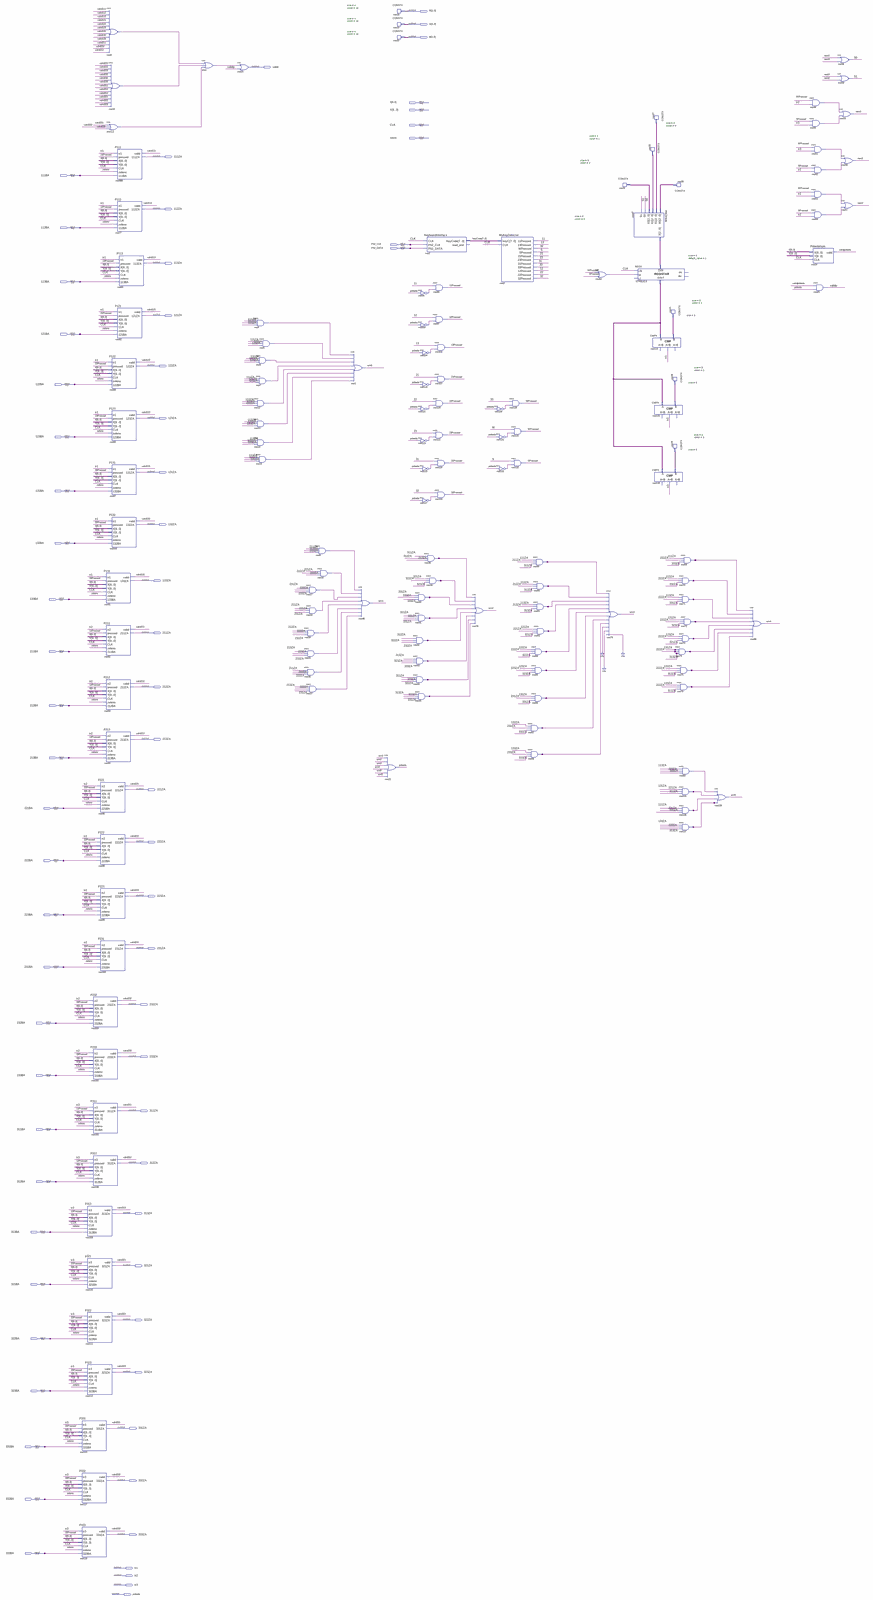
[diagram p0: schematic sheet, whole]
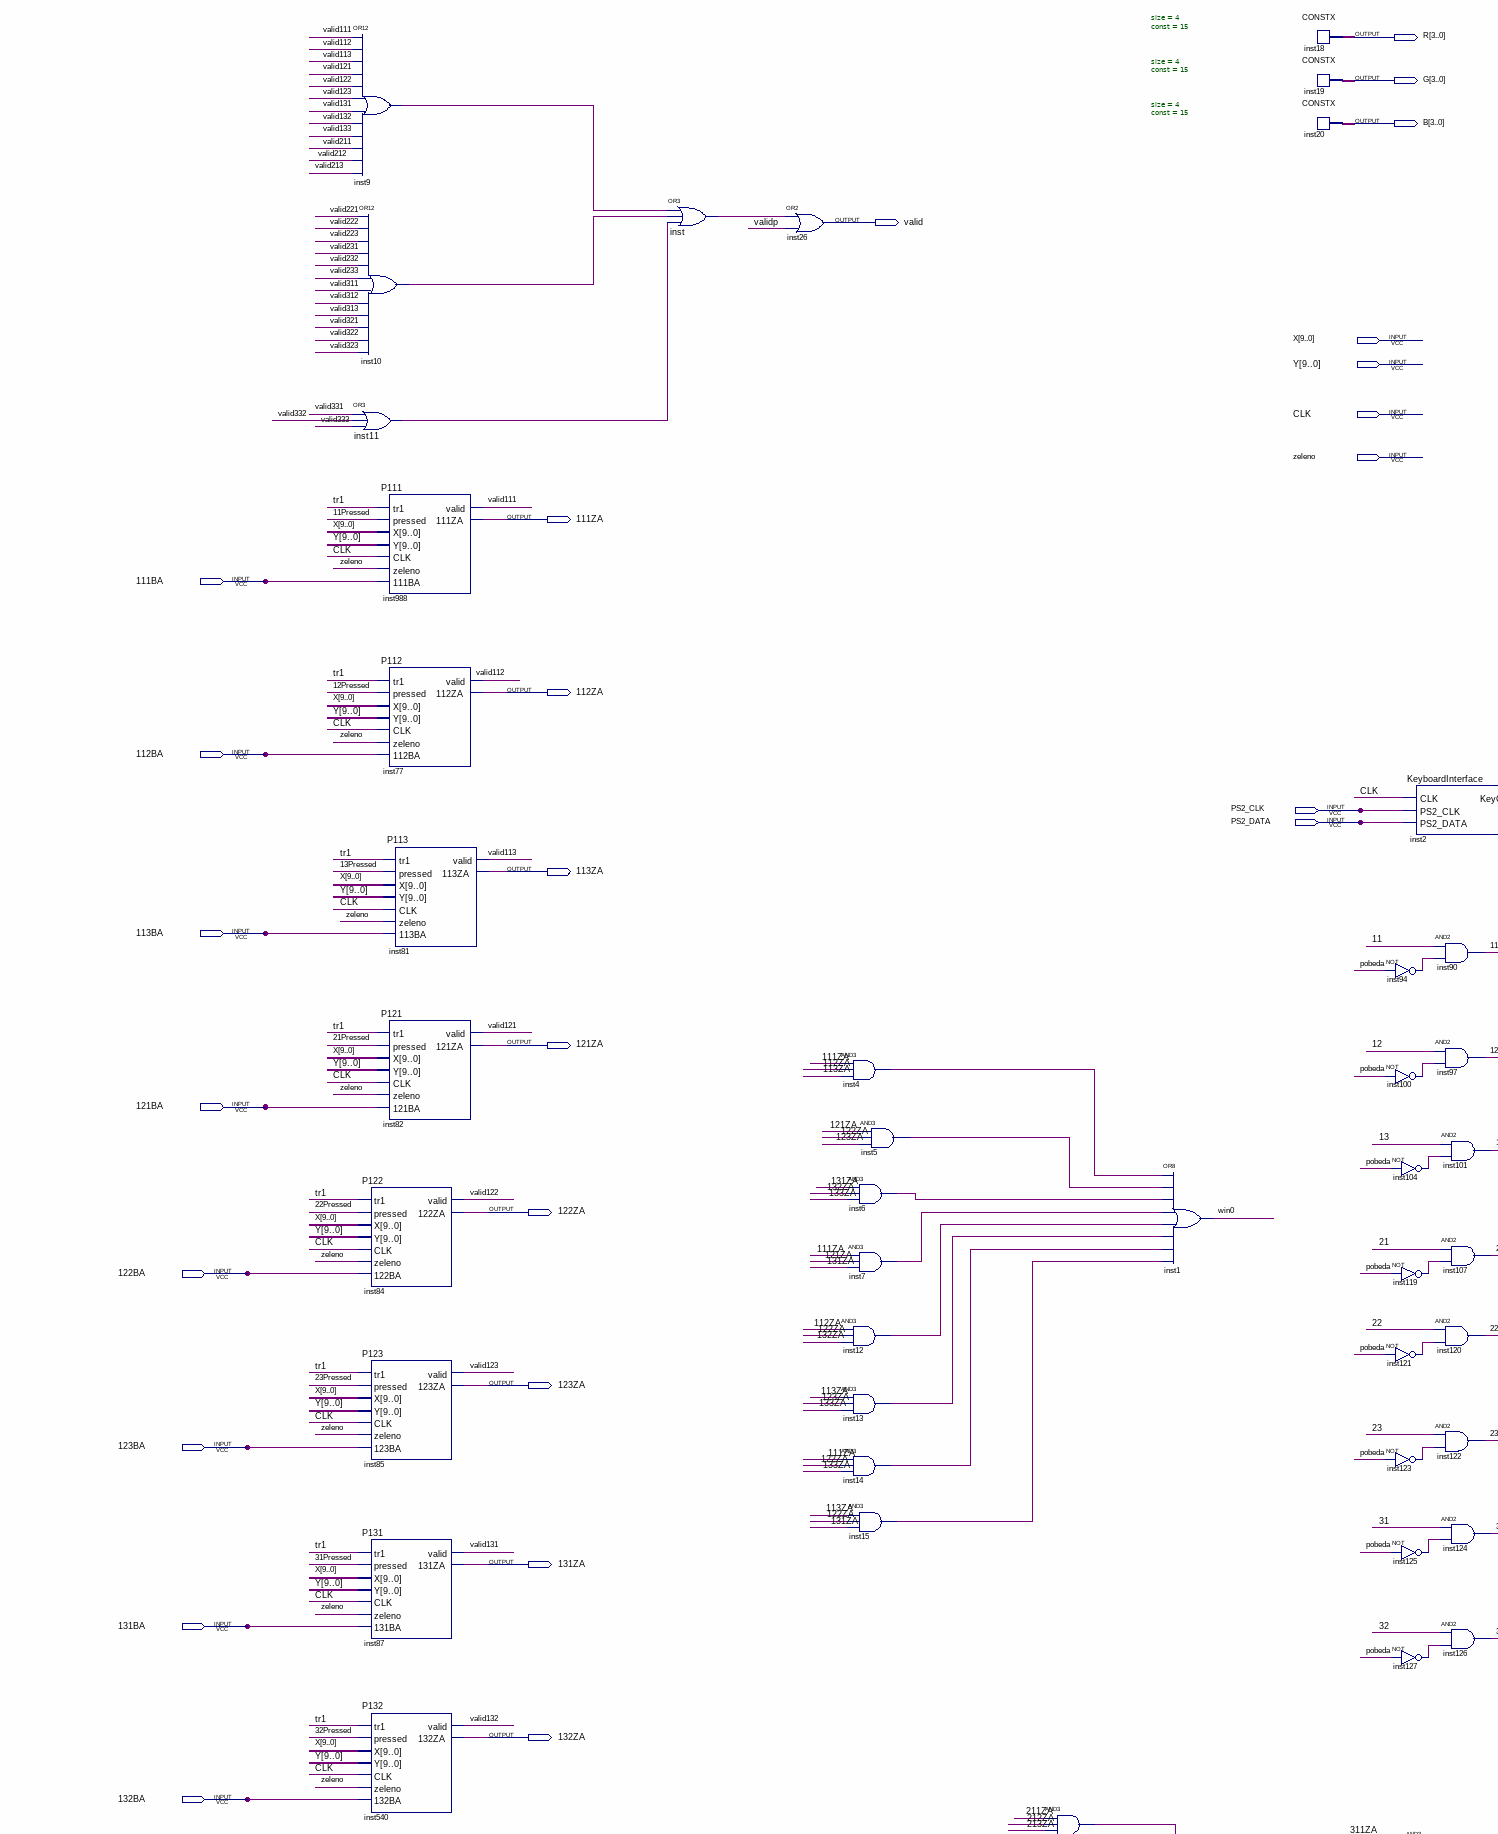
[diagram p1: schematic sheet, upper left part]
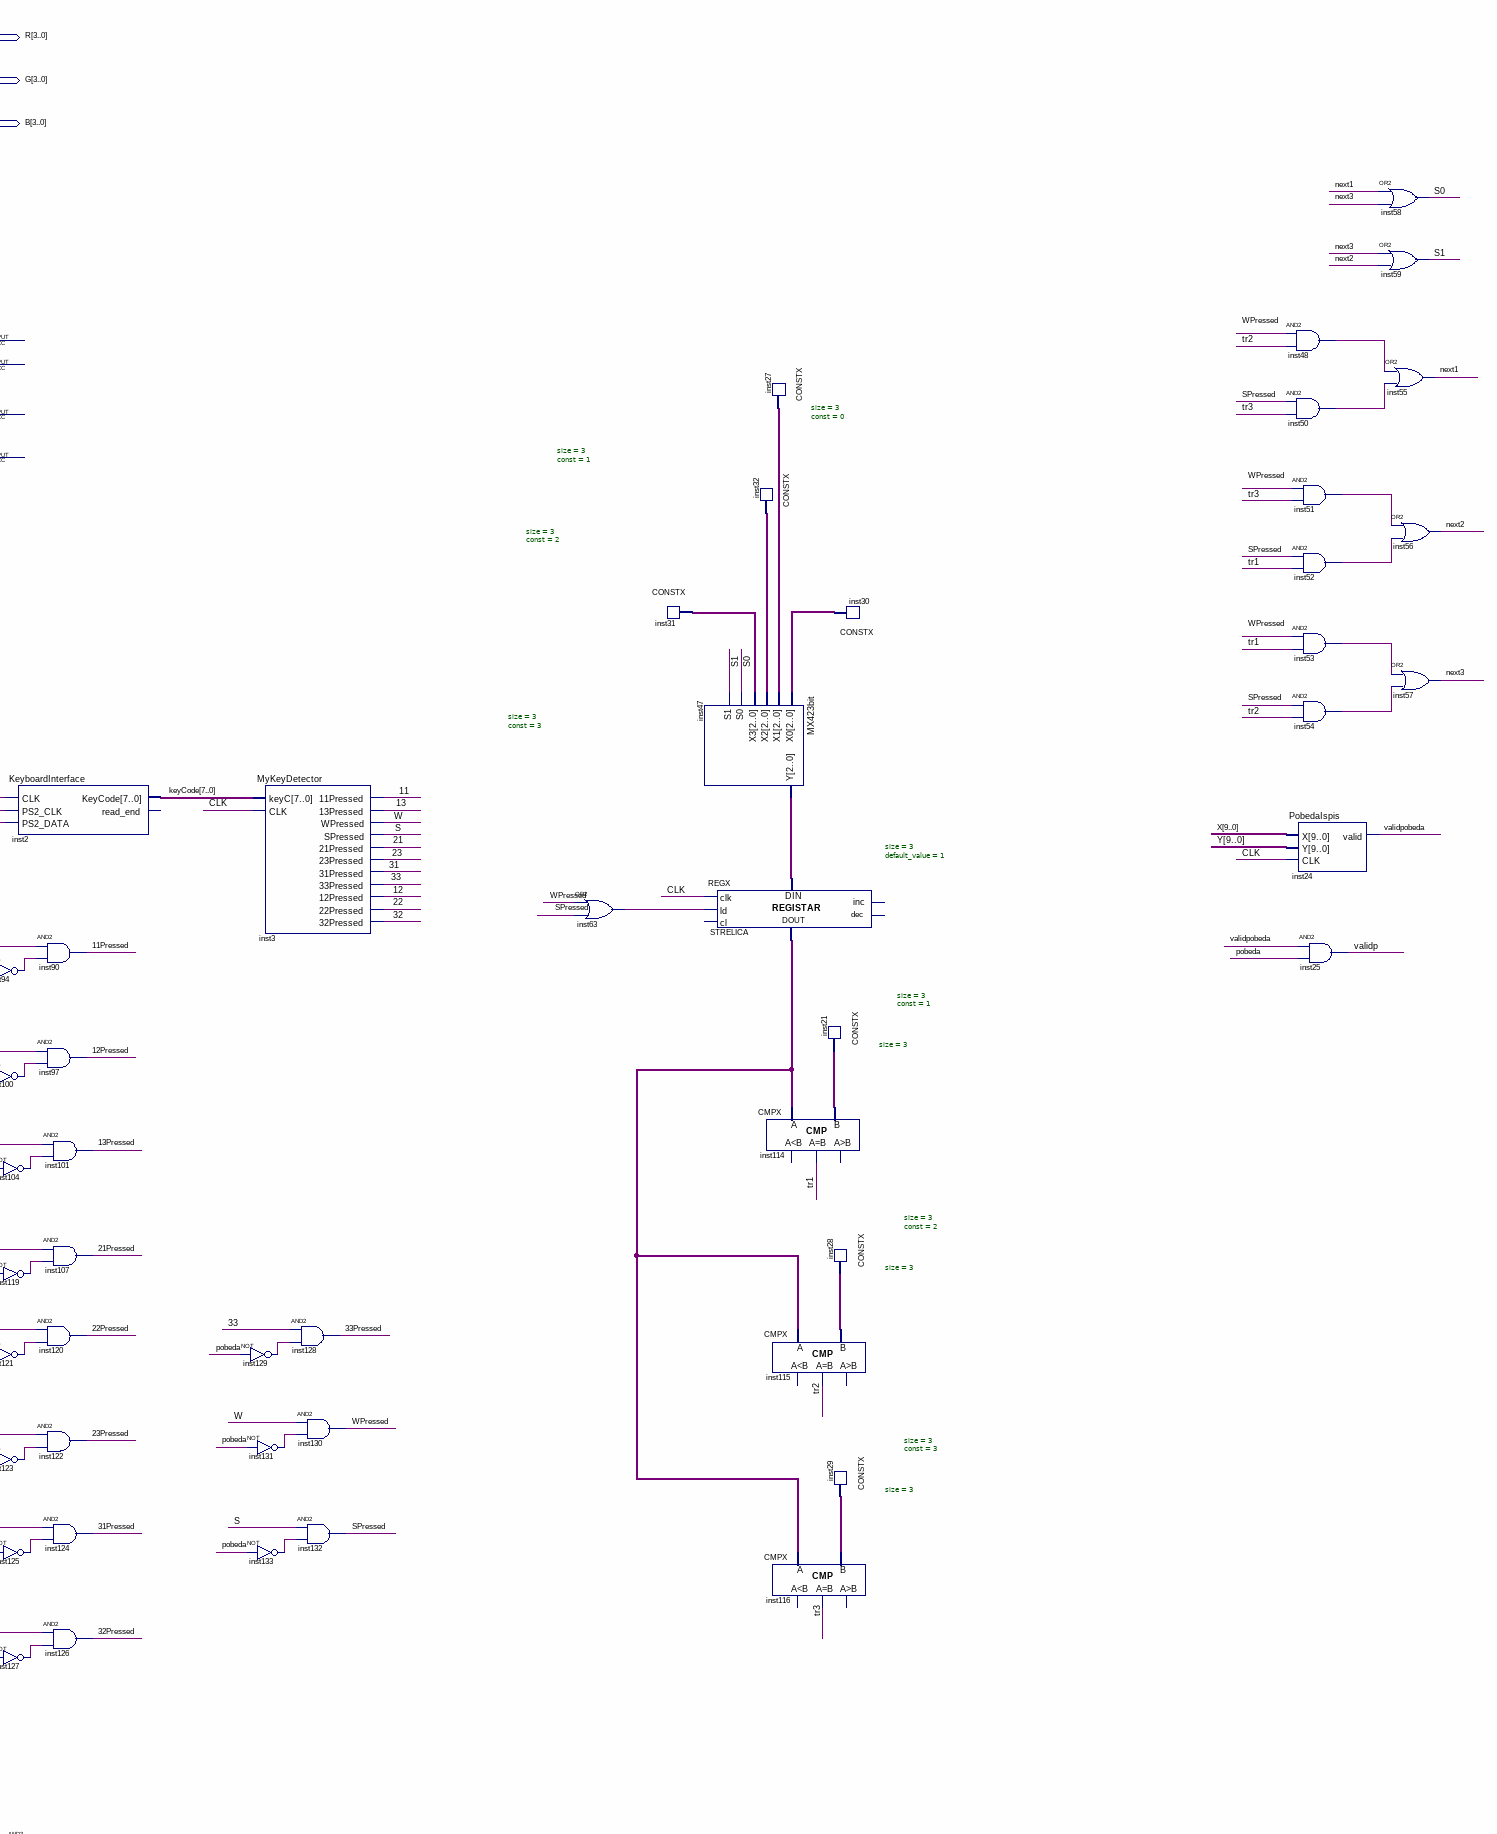
[diagram p2: schematic sheet, upper right part]
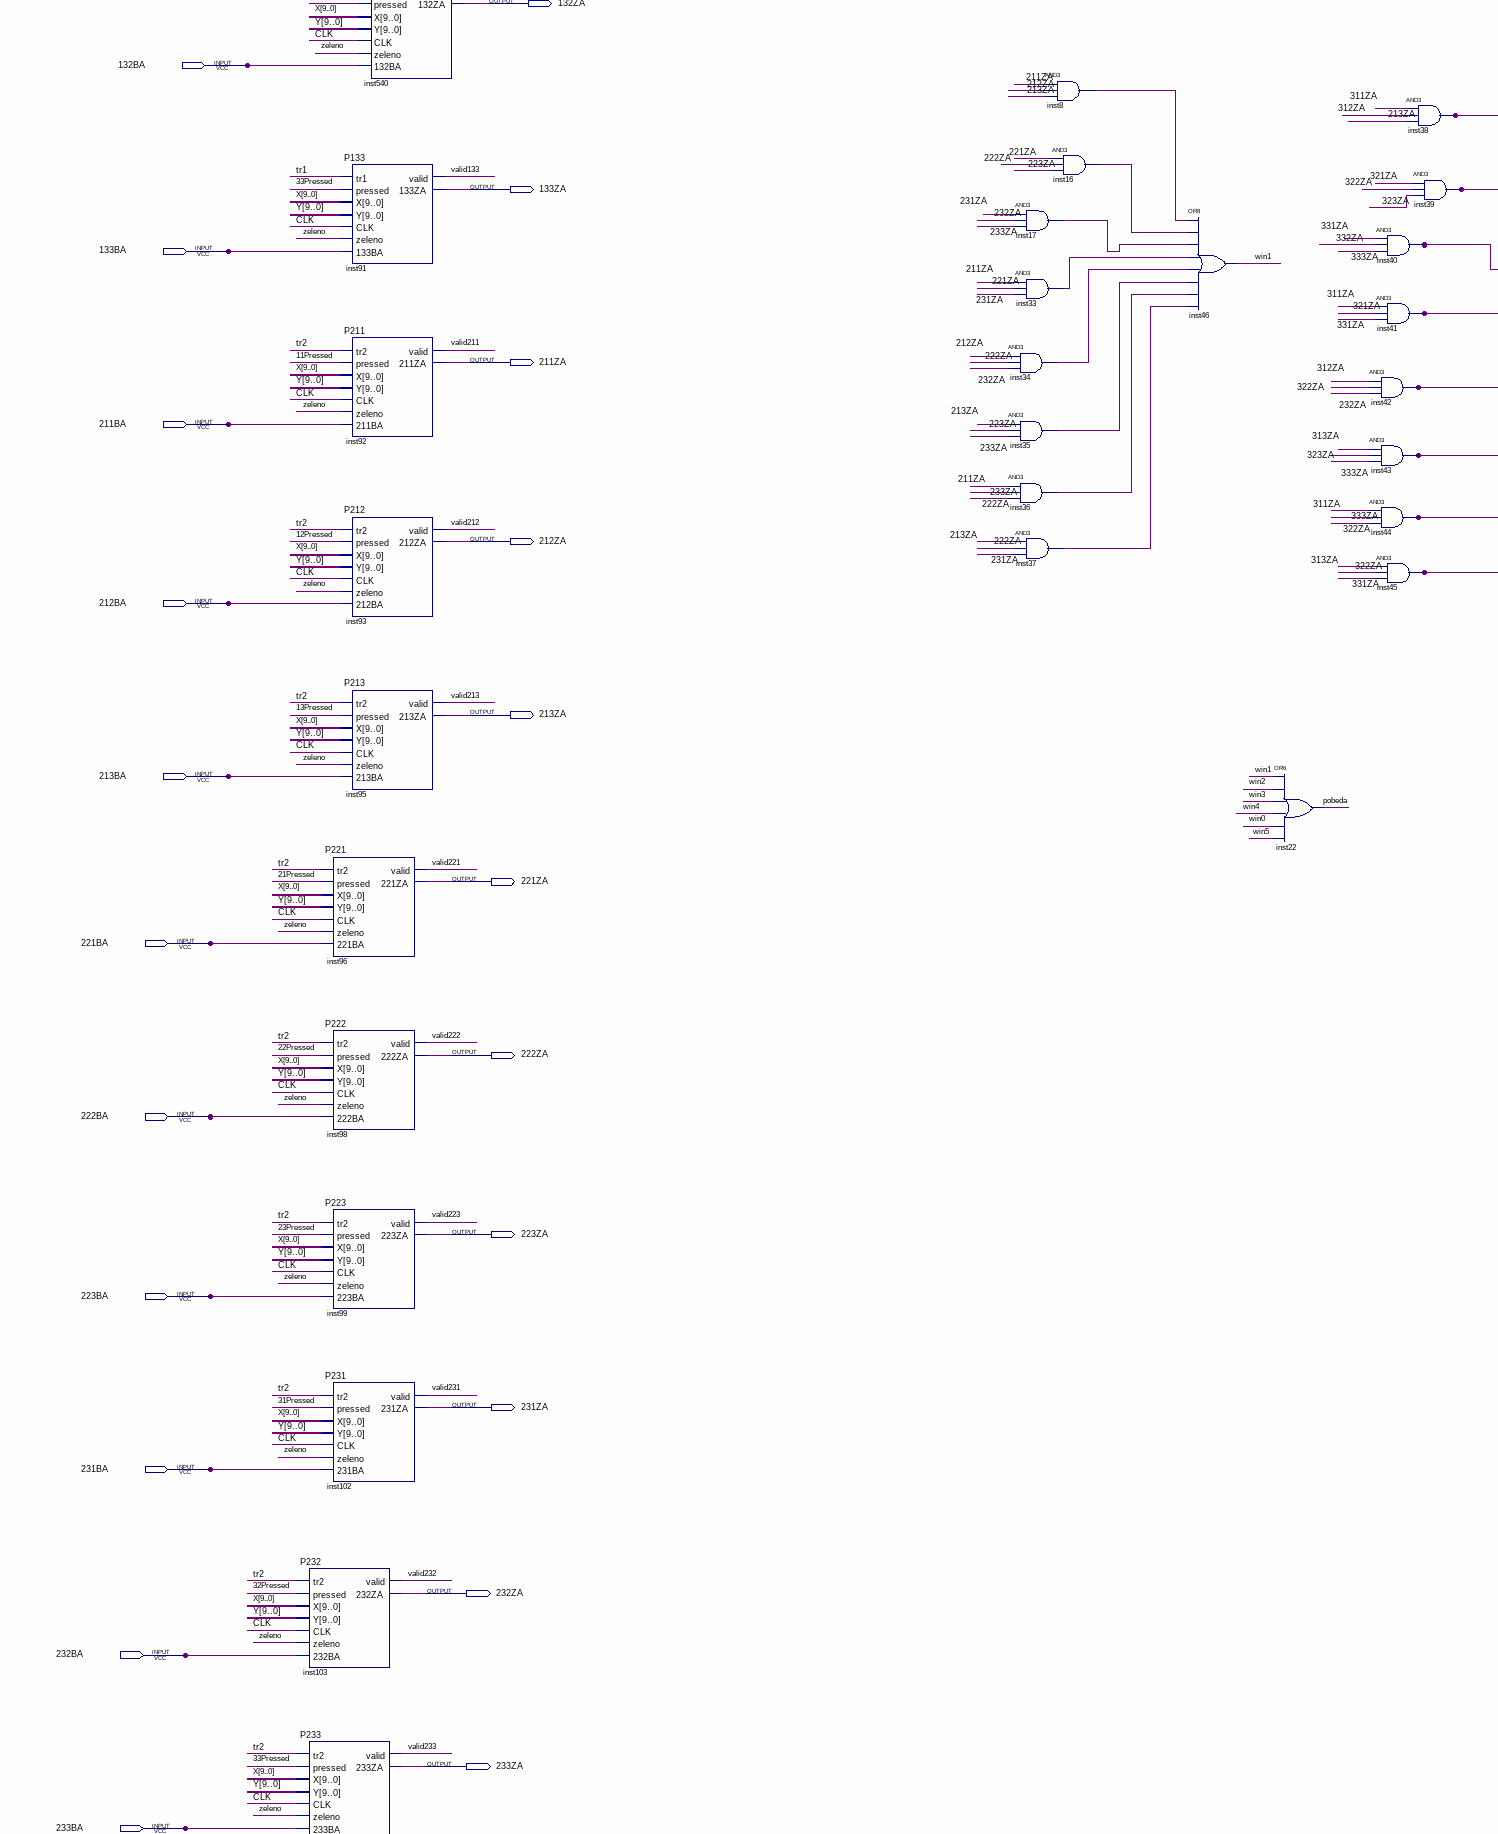
[diagram p3: schematic sheet, middle left part]
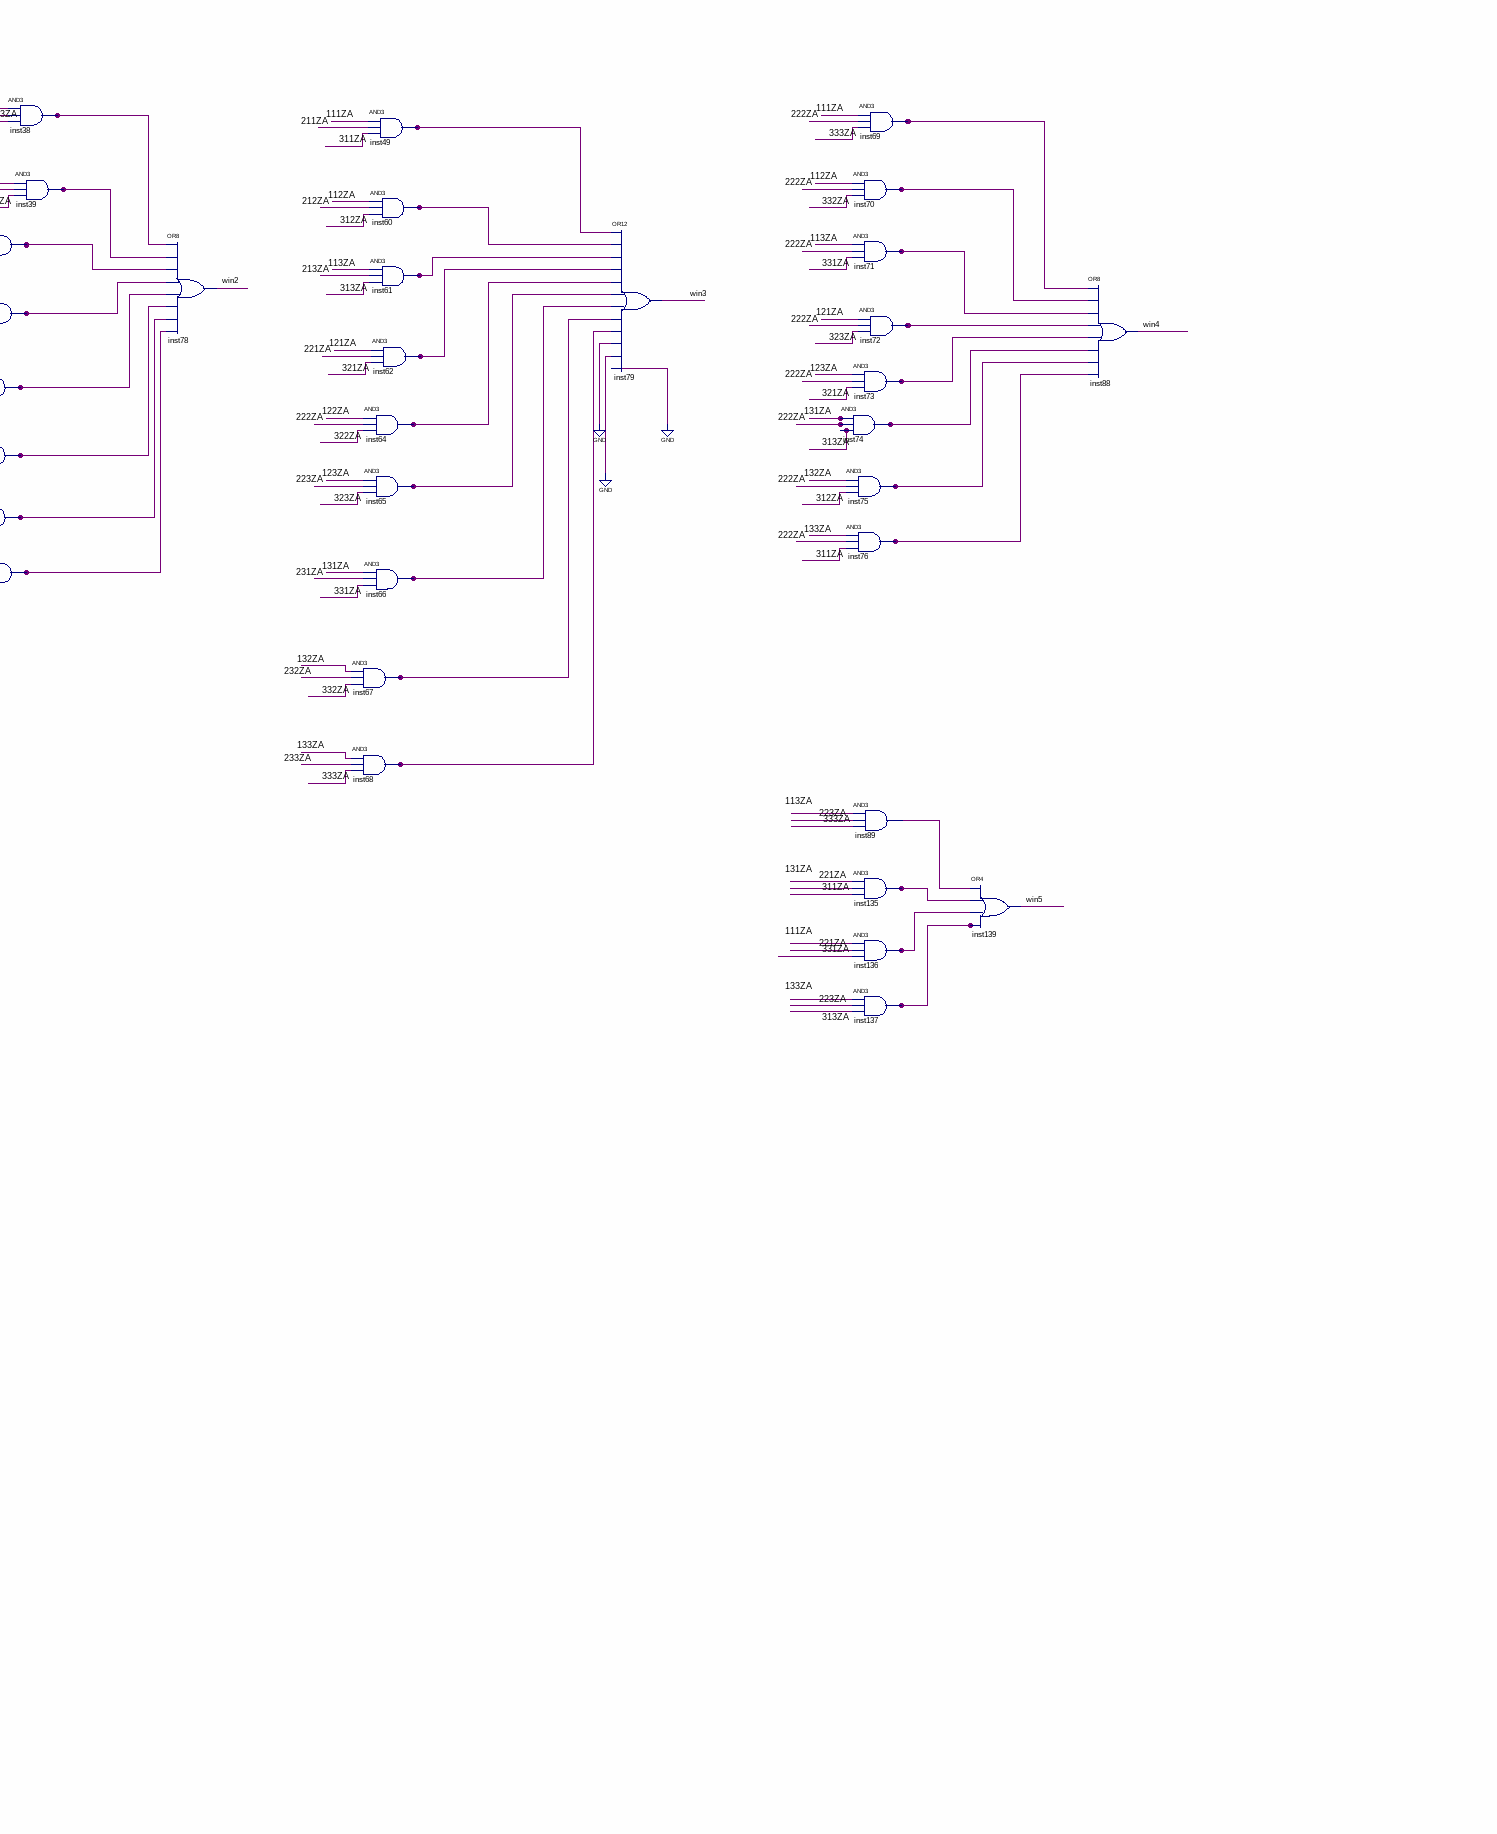
[diagram p4: schematic sheet, middle right part]
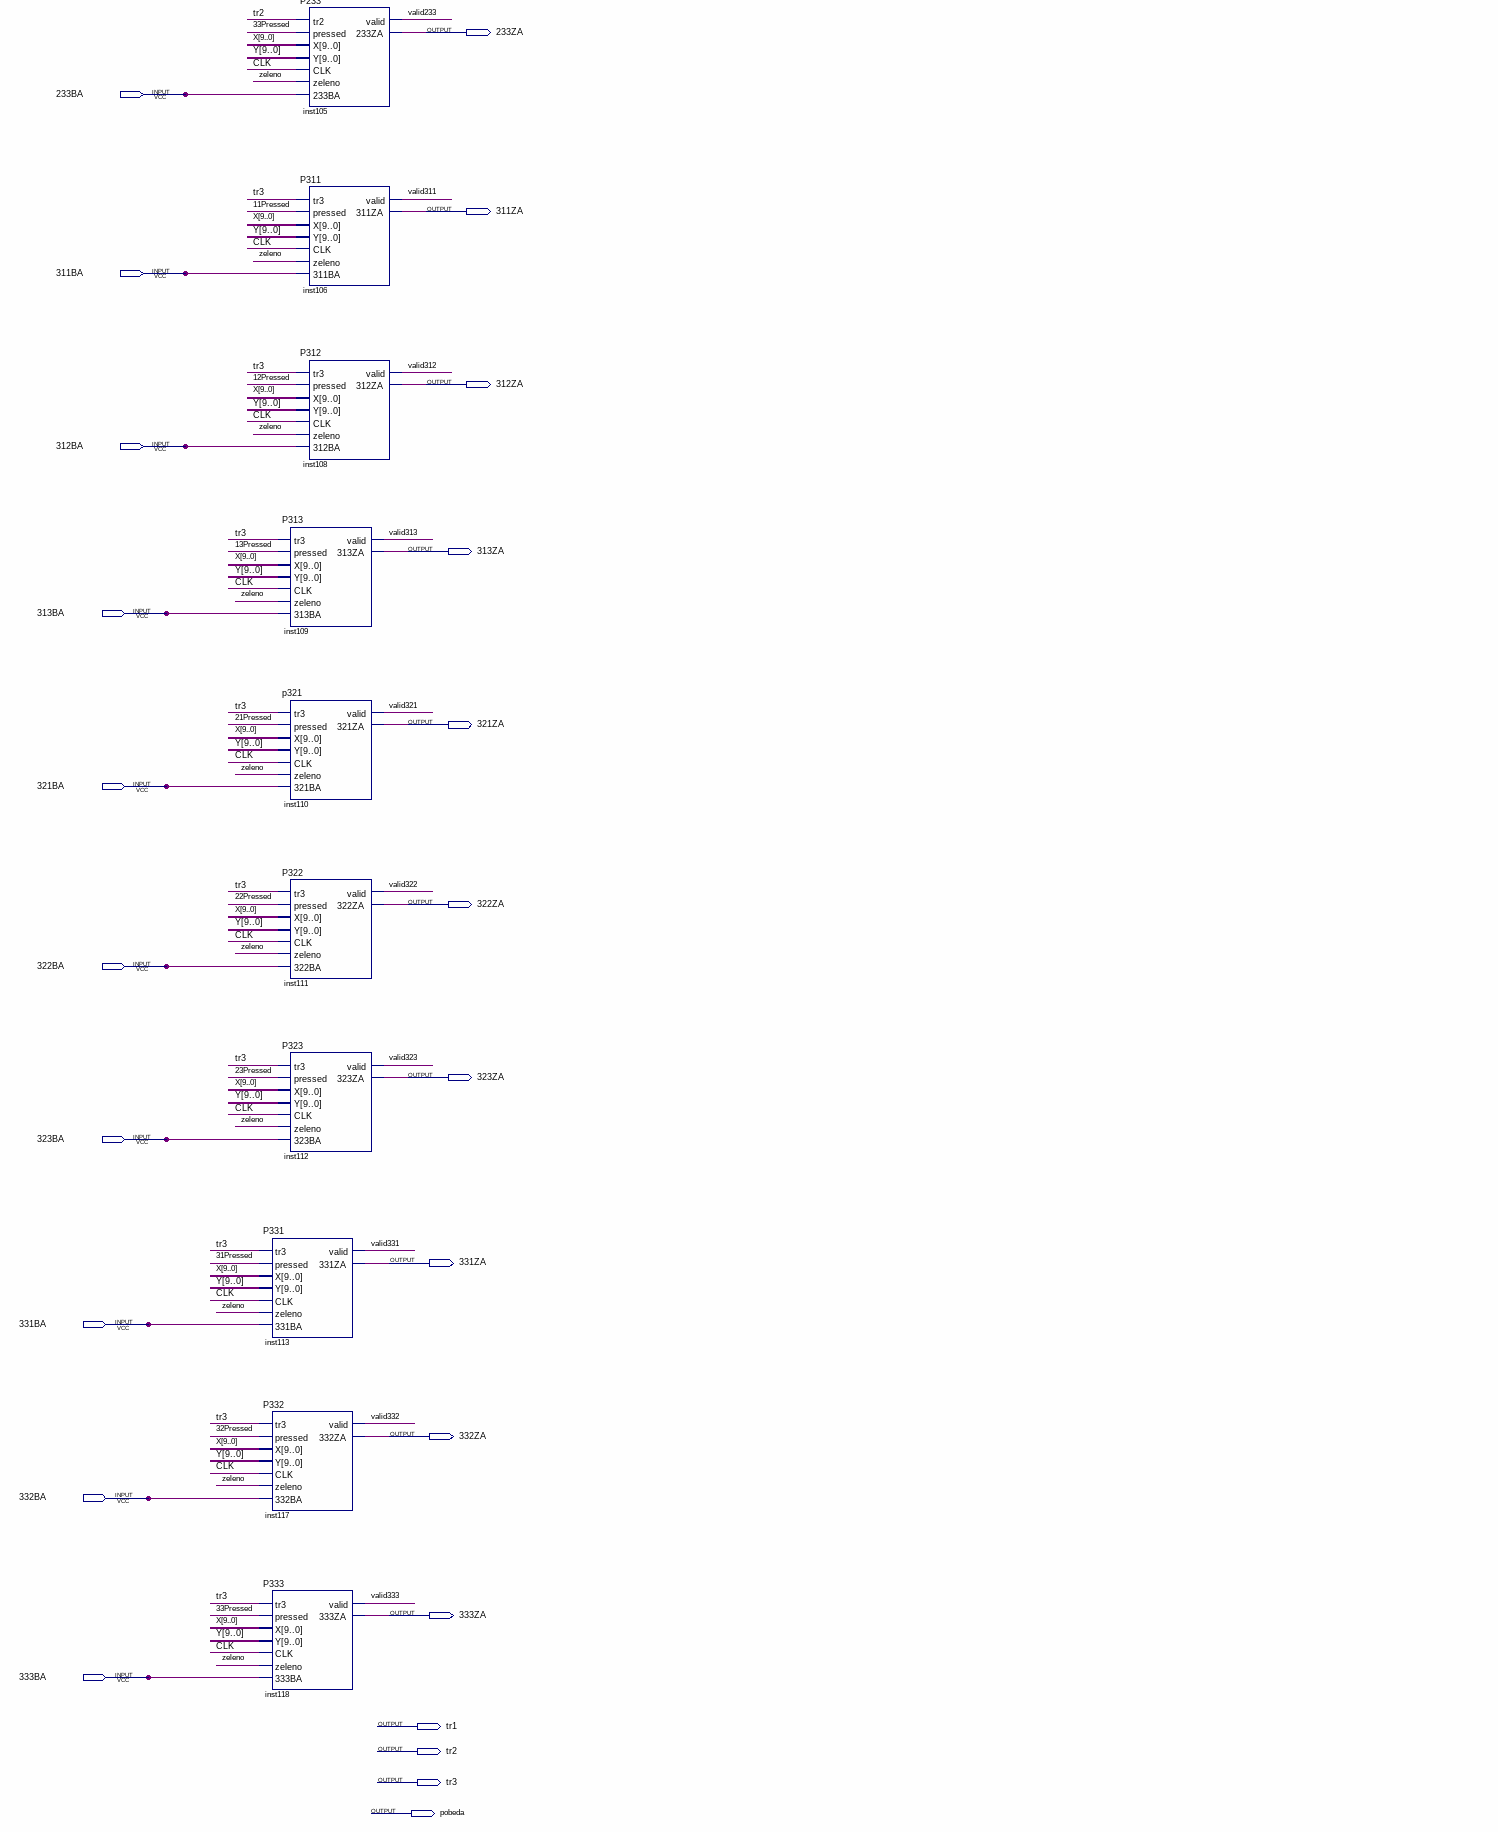
[diagram p5: schematic sheet, lower left part]
// Quartus schematic Layer2.bdf as structural Verilog: 137 symbols, 68 pins
module Layer2 (
  input  [9:0] X,
  input  [9:0] Y,
  input  CLK,
  input  zeleno,
  input  \111BA ,
  input  \112BA ,
  input  PS2_CLK,
  input  PS2_DATA,
  input  \113BA ,
  input  \121BA ,
  input  \122BA ,
  input  \123BA ,
  input  \131BA ,
  input  \132BA ,
  input  \133BA ,
  input  \211BA ,
  input  \212BA ,
  input  \213BA ,
  input  \221BA ,
  input  \222BA ,
  input  \223BA ,
  input  \231BA ,
  input  \232BA ,
  input  \233BA ,
  input  \311BA ,
  input  \312BA ,
  input  \313BA ,
  input  \321BA ,
  input  \322BA ,
  input  \323BA ,
  input  \331BA ,
  input  \332BA ,
  input  \333BA ,
  output [3:0] R,
  output [3:0] G,
  output [3:0] B,
  output valid,
  output \111ZA ,
  output \112ZA ,
  output \113ZA ,
  output \121ZA ,
  output \122ZA ,
  output \123ZA ,
  output \131ZA ,
  output \132ZA ,
  output \133ZA ,
  output \211ZA ,
  output \212ZA ,
  output \213ZA ,
  output \221ZA ,
  output \222ZA ,
  output \223ZA ,
  output \231ZA ,
  output \232ZA ,
  output \233ZA ,
  output \311ZA ,
  output \312ZA ,
  output \313ZA ,
  output \321ZA ,
  output \322ZA ,
  output \323ZA ,
  output \331ZA ,
  output \332ZA ,
  output \333ZA ,
  output tr1,
  output tr2,
  output tr3,
  output pobeda
);

  wire \11 , \11Pressed , \12 , \12Pressed , \13 , \13Pressed , \21 , \21Pressed , \22 , \22Pressed , \23 ,
       \23Pressed , \31 , \31Pressed , \32 , \32Pressed , \33 , \33Pressed , inst4_out, inst5_out, inst6_out,
       inst7_out, inst8_out, inst9_out, inst10_out, inst11_out, inst12_out, inst13_out, inst14_out,
       inst15_out, inst16_out, inst17_out, inst33_out, inst34_out, inst35_out, inst36_out, inst37_out,
       inst38_out, inst39_out, inst40_out, inst41_out, inst42_out, inst43_out, inst44_out, inst45_out,
       inst48_out, inst49_out, inst50_out, inst51_out, inst52_out, inst53_out, inst54_out, inst60_out,
       inst61_out, inst62_out, inst63_out, inst64_out, inst65_out, inst66_out, inst67_out, inst68_out,
       inst69_out, inst70_out, inst71_out, inst72_out, inst73_out, inst74_out, inst75_out, inst76_out,
       inst89_out, inst94_out, inst100_out, inst104_out, inst119_out, inst121_out, inst123_out, inst125_out,
       inst127_out, inst129_out, inst131_out, inst133_out, inst135_out, inst136_out, inst137_out, inst_out,
       next1, next2, next3, S, S0, S1, SPressed, valid111, valid112, valid113, valid121, valid122, valid123,
       valid131, valid132, valid133, valid211, valid212, valid213, valid221, valid222, valid223, valid231,
       valid232, valid233, valid311, valid312, valid313, valid321, valid322, valid323, valid331, valid332,
       valid333, validp, validpobeda, W, win0, win1, win2, win3, win4, win5, WPressed;
  wire [2:0] inst21_data, inst27_data, inst28_data, inst29_data, inst30_data, inst31_data, inst32_data,
       inst47_y, STRELICA_data_out;
  wire [7:0] keyCode;

  P313 inst109 (
    .tr3(tr3), .pressed(\13Pressed ), .X(X), .Y(Y), .CLK(CLK), .zeleno(zeleno), .\313BA (\313BA ),
    .valid(valid313), .\313ZA (\313ZA ));
  p321 inst110 (
    .tr3(tr3), .pressed(\21Pressed ), .X(X), .Y(Y), .CLK(CLK), .zeleno(zeleno), .\321BA (\321BA ),
    .valid(valid321), .\321ZA (\321ZA ));
  P322 inst111 (
    .tr3(tr3), .pressed(\22Pressed ), .X(X), .Y(Y), .CLK(CLK), .zeleno(zeleno), .\322BA (\322BA ),
    .valid(valid322), .\322ZA (\322ZA ));
  P323 inst112 (
    .tr3(tr3), .pressed(\23Pressed ), .X(X), .Y(Y), .CLK(CLK), .zeleno(zeleno), .\323BA (\323BA ),
    .valid(valid323), .\323ZA (\323ZA ));
  P331 inst113 (
    .tr3(tr3), .pressed(\31Pressed ), .X(X), .Y(Y), .CLK(CLK), .zeleno(zeleno), .\331BA (\331BA ),
    .valid(valid331), .\331ZA (\331ZA ));
  P332 inst117 (
    .tr3(tr3), .pressed(\32Pressed ), .X(X), .Y(Y), .CLK(CLK), .zeleno(zeleno), .\332BA (\332BA ),
    .valid(valid332), .\332ZA (\332ZA ));
  P333 inst118 (
    .tr3(tr3), .pressed(\33Pressed ), .X(X), .Y(Y), .CLK(CLK), .zeleno(zeleno), .\333BA (\333BA ),
    .valid(valid333), .\333ZA (\333ZA ));
  P221 inst96 (
    .tr2(tr2), .pressed(\21Pressed ), .X(X), .Y(Y), .CLK(CLK), .zeleno(zeleno), .\221BA (\221BA ),
    .valid(valid221), .\221ZA (\221ZA ));
  P222 inst98 (
    .tr2(tr2), .pressed(\22Pressed ), .X(X), .Y(Y), .CLK(CLK), .zeleno(zeleno), .\222BA (\222BA ),
    .valid(valid222), .\222ZA (\222ZA ));
  P223 inst99 (
    .tr2(tr2), .pressed(\23Pressed ), .X(X), .Y(Y), .CLK(CLK), .zeleno(zeleno), .\223BA (\223BA ),
    .valid(valid223), .\223ZA (\223ZA ));
  P231 inst102 (
    .tr2(tr2), .pressed(\31Pressed ), .X(X), .Y(Y), .CLK(CLK), .zeleno(zeleno), .\231BA (\231BA ),
    .valid(valid231), .\231ZA (\231ZA ));
  P232 inst103 (
    .tr2(tr2), .pressed(\32Pressed ), .X(X), .Y(Y), .CLK(CLK), .zeleno(zeleno), .\232BA (\232BA ),
    .valid(valid232), .\232ZA (\232ZA ));
  P233 inst105 (
    .tr2(tr2), .pressed(\33Pressed ), .X(X), .Y(Y), .CLK(CLK), .zeleno(zeleno), .\233BA (\233BA ),
    .valid(valid233), .\233ZA (\233ZA ));
  P311 inst106 (
    .tr3(tr3), .pressed(\11Pressed ), .X(X), .Y(Y), .CLK(CLK), .zeleno(zeleno), .\311BA (\311BA ),
    .valid(valid311), .\311ZA (\311ZA ));
  P312 inst108 (
    .tr3(tr3), .pressed(\12Pressed ), .X(X), .Y(Y), .CLK(CLK), .zeleno(zeleno), .\312BA (\312BA ),
    .valid(valid312), .\312ZA (\312ZA ));
  or inst9 (inst9_out, valid111, valid112, valid113, valid121, valid122, valid123, valid131, valid132, valid133, valid211, valid212, valid213);
  or inst10 (inst10_out, valid221, valid222, valid223, valid231, valid232, valid233, valid311, valid312, valid313, valid321, valid322, valid323);
  or inst11 (inst11_out, valid331, valid332, valid333);
  P111 inst988 (
    .tr1(tr1), .pressed(\11Pressed ), .X(X), .Y(Y), .CLK(CLK), .zeleno(zeleno), .\111BA (\111BA ),
    .valid(valid111), .\111ZA (\111ZA ));
  P112 inst77 (
    .tr1(tr1), .pressed(\12Pressed ), .X(X), .Y(Y), .CLK(CLK), .zeleno(zeleno), .\112BA (\112BA ),
    .valid(valid112), .\112ZA (\112ZA ));
  P113 inst81 (
    .tr1(tr1), .pressed(\13Pressed ), .X(X), .Y(Y), .CLK(CLK), .zeleno(zeleno), .\113BA (\113BA ),
    .valid(valid113), .\113ZA (\113ZA ));
  P121 inst82 (
    .tr1(tr1), .pressed(\21Pressed ), .X(X), .Y(Y), .CLK(CLK), .zeleno(zeleno), .\121BA (\121BA ),
    .valid(valid121), .\121ZA (\121ZA ));
  P122 inst84 (
    .tr1(tr1), .pressed(\22Pressed ), .X(X), .Y(Y), .CLK(CLK), .zeleno(zeleno), .\122BA (\122BA ),
    .valid(valid122), .\122ZA (\122ZA ));
  P123 inst85 (
    .tr1(tr1), .pressed(\23Pressed ), .X(X), .Y(Y), .CLK(CLK), .zeleno(zeleno), .\123BA (\123BA ),
    .valid(valid123), .\123ZA (\123ZA ));
  P131 inst87 (
    .tr1(tr1), .pressed(\31Pressed ), .X(X), .Y(Y), .CLK(CLK), .zeleno(zeleno), .\131BA (\131BA ),
    .valid(valid131), .\131ZA (\131ZA ));
  P132 inst540 (
    .tr1(tr1), .pressed(\32Pressed ), .X(X), .Y(Y), .CLK(CLK), .zeleno(zeleno), .\132BA (\132BA ),
    .valid(valid132), .\132ZA (\132ZA ));
  P133 inst91 (
    .tr1(tr1), .pressed(\33Pressed ), .X(X), .Y(Y), .CLK(CLK), .zeleno(zeleno), .\133BA (\133BA ),
    .valid(valid133), .\133ZA (\133ZA ));
  P211 inst92 (
    .tr2(tr2), .pressed(\11Pressed ), .X(X), .Y(Y), .CLK(CLK), .zeleno(zeleno), .\211BA (\211BA ),
    .valid(valid211), .\211ZA (\211ZA ));
  P212 inst93 (
    .tr2(tr2), .pressed(\12Pressed ), .X(X), .Y(Y), .CLK(CLK), .zeleno(zeleno), .\212BA (\212BA ),
    .valid(valid212), .\212ZA (\212ZA ));
  P213 inst95 (
    .tr2(tr2), .pressed(\13Pressed ), .X(X), .Y(Y), .CLK(CLK), .zeleno(zeleno), .\213BA (\213BA ),
    .valid(valid213), .\213ZA (\213ZA ));
  or inst (inst_out, inst9_out, inst10_out, inst11_out);
  or inst26 (valid, inst_out, validp);
  and inst4 (inst4_out, \111ZA , \112ZA , \113ZA );
  and inst5 (inst5_out, \121ZA , \122ZA , \123ZA );
  and inst6 (inst6_out, \131ZA , \132ZA , \133ZA );
  and inst7 (inst7_out, \111ZA , \121ZA , \131ZA );
  and inst12 (inst12_out, \112ZA , \122ZA , \132ZA );
  and inst13 (inst13_out, \113ZA , \123ZA , \133ZA );
  and inst14 (inst14_out, \111ZA , \122ZA , \133ZA );
  and inst15 (inst15_out, \113ZA , \122ZA , \131ZA );
  and inst17 (inst17_out, \231ZA , \232ZA , \233ZA );
  and inst33 (inst33_out, \211ZA , \221ZA , \231ZA );
  and inst34 (inst34_out, \212ZA , \222ZA , \232ZA );
  and inst35 (inst35_out, \213ZA , \223ZA , \233ZA );
  and inst36 (inst36_out, \211ZA , \222ZA , \233ZA );
  and inst37 (inst37_out, \213ZA , \222ZA , \231ZA );
  and inst8 (inst8_out, \211ZA , \212ZA , \213ZA );
  and inst16 (inst16_out, \221ZA , \222ZA , \223ZA );
  or inst1 (win0, inst4_out, inst5_out, inst6_out, inst7_out, inst12_out, inst13_out, inst14_out, inst15_out);
  or inst46 (win1, inst8_out, inst16_out, inst17_out, inst33_out, inst34_out, inst35_out, inst36_out, inst37_out);
  or inst22 (pobeda, win1, win2, win3, win4, win0, win5);
  CONSTX #(.size(4), .\const (15)) inst18 (.data(R));
  CONSTX #(.size(4), .\const (15)) inst19 (.data(G));
  CONSTX #(.size(4), .\const (15)) inst20 (.data(B));
  and inst40 (inst40_out, \331ZA , \332ZA , \333ZA );
  and inst41 (inst41_out, \311ZA , \321ZA , \331ZA );
  and inst42 (inst42_out, \312ZA , \322ZA , \232ZA );
  and inst43 (inst43_out, \313ZA , \323ZA , \333ZA );
  and inst44 (inst44_out, \311ZA , \322ZA , \333ZA );
  and inst45 (inst45_out, \313ZA , \322ZA , \331ZA );
  KeyboardInterface inst2 (.CLK(CLK), .PS2_CLK(PS2_CLK), .PS2_DATA(PS2_DATA), .KeyCode(keyCode));  // open: read_end
  not inst94 (inst94_out, pobeda);
  not inst100 (inst100_out, pobeda);
  not inst104 (inst104_out, pobeda);
  not inst119 (inst119_out, pobeda);
  not inst121 (inst121_out, pobeda);
  not inst123 (inst123_out, pobeda);
  not inst125 (inst125_out, pobeda);
  not inst127 (inst127_out, pobeda);
  and inst38 (inst38_out, \311ZA , \312ZA , \213ZA );
  and inst39 (inst39_out, \321ZA , \322ZA , \323ZA );
  and inst90 (\11Pressed , \11 , inst94_out);
  and inst97 (\12Pressed , \12 , inst100_out);
  and inst101 (\13Pressed , \13 , inst104_out);
  and inst107 (\21Pressed , \21 , inst119_out);
  and inst120 (\22Pressed , \22 , inst121_out);
  and inst122 (\23Pressed , \23 , inst123_out);
  and inst124 (\31Pressed , \31 , inst125_out);
  and inst126 (\32Pressed , \32 , inst127_out);
  or inst78 (win2, inst38_out, inst39_out, inst40_out, inst41_out, inst42_out, inst43_out, inst44_out, inst45_out);
  MyKeyDetector inst3 (
    .keyC(keyCode), .CLK(CLK), .\11Pressed (\11 ), .\13Pressed (\13 ), .WPressed(W), .SPressed(S),
    .\21Pressed (\21 ), .\23Pressed (\23 ), .\31Pressed (\31 ), .\33Pressed (\33 ), .\12Pressed (\12 ),
    .\22Pressed (\22 ), .\32Pressed (\32 ));
  not inst129 (inst129_out, pobeda);
  not inst131 (inst131_out, pobeda);
  not inst133 (inst133_out, pobeda);
  and inst128 (\33Pressed , \33 , inst129_out);
  and inst130 (WPressed, W, inst131_out);
  and inst132 (SPressed, S, inst133_out);
  and inst49 (inst49_out, \111ZA , \211ZA , \311ZA );
  and inst60 (inst60_out, \112ZA , \212ZA , \312ZA );
  and inst61 (inst61_out, \113ZA , \213ZA , \313ZA );
  and inst62 (inst62_out, \121ZA , \221ZA , \321ZA );
  and inst64 (inst64_out, \122ZA , \222ZA , \322ZA );
  and inst65 (inst65_out, \123ZA , \223ZA , \323ZA );
  and inst66 (inst66_out, \131ZA , \231ZA , \331ZA );
  and inst67 (inst67_out, \132ZA , \232ZA , \332ZA );
  and inst68 (inst68_out, \133ZA , \233ZA , \333ZA );
  or inst63 (inst63_out, WPressed, SPressed);
  or inst79 (win3, inst49_out, inst60_out, inst61_out, inst62_out, inst64_out, inst65_out, inst66_out, inst67_out, inst68_out, 1'b0, 1'b0, 1'b0);
  CONSTX #(.size(3), .\const (3)) inst31 (.data(inst31_data));
  MX423bit inst47 (
    .X0(inst30_data), .X1(inst27_data), .X2(inst32_data), .X3(inst31_data), .S0(S0), .S1(S1), .Y(inst47_y));
  REGX #(.size(3), .default_value(1)) STRELICA (
    .clk(CLK), .ld(inst63_out), .data_in(inst47_y), .data_out(STRELICA_data_out));  // open: cl, inc, dec
  CONSTX #(.size(3), .\const (1)) inst27 (.data(inst27_data));
  CONSTX #(.size(3), .\const (2)) inst32 (.data(inst32_data));
  CMPX #(.size(3)) inst114 (.A(STRELICA_data_out), .B(inst21_data), .eq(tr1));  // open: ls, gr
  CMPX #(.size(3)) inst115 (.A(STRELICA_data_out), .B(inst28_data), .eq(tr2));  // open: ls, gr
  CMPX #(.size(3)) inst116 (.A(STRELICA_data_out), .B(inst29_data), .eq(tr3));  // open: ls, gr
  CONSTX #(.size(3), .\const (1)) inst21 (.data(inst21_data));
  CONSTX #(.size(3), .\const (0)) inst30 (.data(inst30_data));
  CONSTX #(.size(3), .\const (2)) inst28 (.data(inst28_data));
  CONSTX #(.size(3), .\const (3)) inst29 (.data(inst29_data));
  and inst69 (inst69_out, \111ZA , \222ZA , \333ZA );
  and inst70 (inst70_out, \112ZA , \222ZA , \332ZA );
  and inst71 (inst71_out, \113ZA , \222ZA , \331ZA );
  and inst72 (inst72_out, \121ZA , \222ZA , \323ZA );
  and inst73 (inst73_out, \123ZA , \222ZA , \321ZA );
  and inst74 (inst74_out, \131ZA , \222ZA , \313ZA );
  and inst75 (inst75_out, \132ZA , \222ZA , \312ZA );
  and inst76 (inst76_out, \133ZA , \222ZA , \311ZA );
  and inst89 (inst89_out, \113ZA , \223ZA , \333ZA );
  and inst135 (inst135_out, \131ZA , \221ZA , \311ZA );
  and inst136 (inst136_out, \111ZA , \221ZA , \331ZA );
  and inst137 (inst137_out, \133ZA , \223ZA , \313ZA );
  or inst139 (win5, inst89_out, inst135_out, inst136_out, inst137_out);
  or inst88 (win4, inst69_out, inst70_out, inst71_out, inst72_out, inst73_out, inst74_out, inst75_out, inst76_out);
  and inst48 (inst48_out, WPressed, tr2);
  and inst50 (inst50_out, SPressed, tr3);
  and inst51 (inst51_out, WPressed, tr3);
  and inst52 (inst52_out, SPressed, tr1);
  and inst53 (inst53_out, WPressed, tr1);
  and inst54 (inst54_out, SPressed, tr2);
  PobedaIspis inst24 (.X(X), .Y(Y), .CLK(CLK), .valid(validpobeda));
  and inst25 (validp, validpobeda, pobeda);
  or inst58 (S0, next1, next3);
  or inst59 (S1, next3, next2);
  or inst55 (next1, inst48_out, inst50_out);
  or inst56 (next2, inst51_out, inst52_out);
  or inst57 (next3, inst53_out, inst54_out);
endmodule
